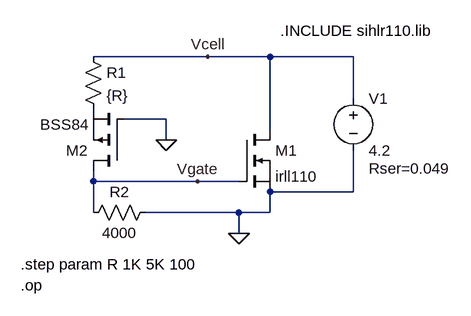
[diagram p0: schematic DischargeNMOSOnly.asc]
DischargeNMOSOnly.asc, the LTspice schematic file:
Version 4
SHEET 1 880 680
WIRE 96 32 -80 32
WIRE 192 32 96 32
WIRE 320 32 192 32
WIRE 320 96 320 32
WIRE 32 128 -32 128
WIRE 192 144 192 32
WIRE 32 160 32 128
WIRE -80 224 -80 208
WIRE 80 224 -80 224
WIRE 144 224 80 224
WIRE 320 240 320 176
WIRE 320 240 192 240
WIRE -80 272 -80 224
WIRE 144 272 0 272
WIRE 192 272 192 240
WIRE 192 272 144 272
WIRE 144 304 144 272
FLAG 144 304 0
FLAG 96 32 Vcell
FLAG 80 224 Vgate
FLAG 32 160 0
SYMBOL nmos 144 144 R0
SYMATTR InstName M1
SYMATTR Value irll110
SYMATTR Prefix X
SYMBOL pmos -32 208 R180
SYMATTR InstName M2
SYMATTR Value BSS84
SYMBOL res -96 16 R0
SYMATTR InstName R1
SYMATTR Value {R}
SYMATTR SpiceLine tol=1 pwr=0.1
SYMBOL res 16 256 R90
WINDOW 0 0 56 VBottom 2
WINDOW 3 32 56 VTop 2
SYMATTR InstName R2
SYMATTR Value 4000
SYMBOL voltage 320 80 R0
WINDOW 123 0 0 Left 0
WINDOW 39 24 124 Left 2
SYMATTR InstName V1
SYMATTR Value 4.2
SYMATTR SpiceLine Rser=0.049
TEXT 208 -8 Left 2 !.INCLUDE sihlr110.lib
TEXT -192 384 Left 2 !.op
TEXT -192 352 Left 2 !.step param R 1K 5K 100

The netlist it stands for:
* DischargeNMOSOnly.asc
XM1 Vcell Vgate 0 irll110  ; pins D G S
M2 Vgate 0 P001 P001 BSS84
R1 Vcell P001 {R} tol=1 pwr=0.1
R2 0 Vgate 4000
V1 Vcell 0 4.2 Rser=0.049
.model NMOS NMOS
.model PMOS PMOS
.lib standard.mos
.INCLUDE sihlr110.lib
.op
.step param R 1K 5K 100
.backanno
.end

* Results of the author's LTspice run, read from the files saved beside the schematic
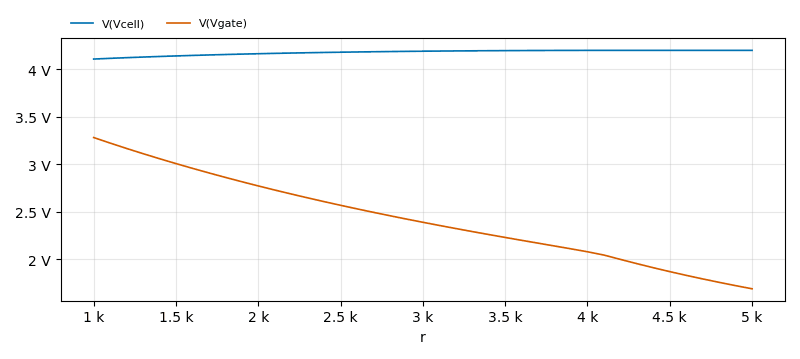
[diagram p1: Operating Point of DischargeNMOSOnly.asc, plotted from the saved traces]
* Operating Point, 1 run:
*   V(Vcell): 4.108 V at r=1 k, 4.2 V at r=5 k, min 4.108 V, max 4.2 V
*   V(Vgate): 3.281 V at r=1 k, 1.687 V at r=5 k, min 1.687 V, max 3.281 V
* From the log:
*   Semiconductor Device Operating Points:
*                           --- Diodes ---
*   Name:    d:m1:4      d:m1:3      d:m1:2      d:m1:1
*   Model:   m1:md3      m1:md2      m1:md1       m1:md
*   Id:     -1.00e-10   -1.00e-10   -4.43e-13   -9.62e-12
*   Vd:     -4.43e-01   -4.43e-01   -4.43e-01   -4.11e+00
*   Req:     1.00e+12    1.00e+12    1.00e+12    1.00e+12
*   CAP:     0.00e+00    0.00e+00    1.40e-10    1.29e-10
*                           --- VDMOSFET Transistors ---
*   Name:          m2
*   Model:        bss84
*   Id:         -8.20e-04
*   Vgs:        -3.29e+00
*   Vds:        -6.91e-03
*   Vth:        -2.10e+00
*   Gm:          6.92e-04
*   Gds:         2.37e-01
*   Cgs:         2.00e-11
*   Cgd:         4.00e-11
*   Cbody:       9.97e-12
*                           --- MOSFET Transistors ---
*   Name:        m:m1:1
*   Model:        m1:mm
*   Id:          1.87e+00
*   Vgs:         3.12e+00
*   Vds:         3.56e+00
*   Vbs:         0.00e+00
*   Vth:         2.04e+00
*   Vdsat:       1.08e+00
*   Gm:          3.46e+00
*   Gds:         4.95e-03
*   Gmb:         0.00e+00
*   Cbd:         0.00e+00
*   Cbs:         0.00e+00
*   Cgsov:       2.31e-10
*   Cgdov:       5.35e-12
*   Cgbov:       0.00e+00
*   Cgs:         0.00e+00
*   Cgd:         0.00e+00
*   Cgb:         0.00e+00